# EAGLE design CaravanPi_V3 (EAGLE 9.6.2)
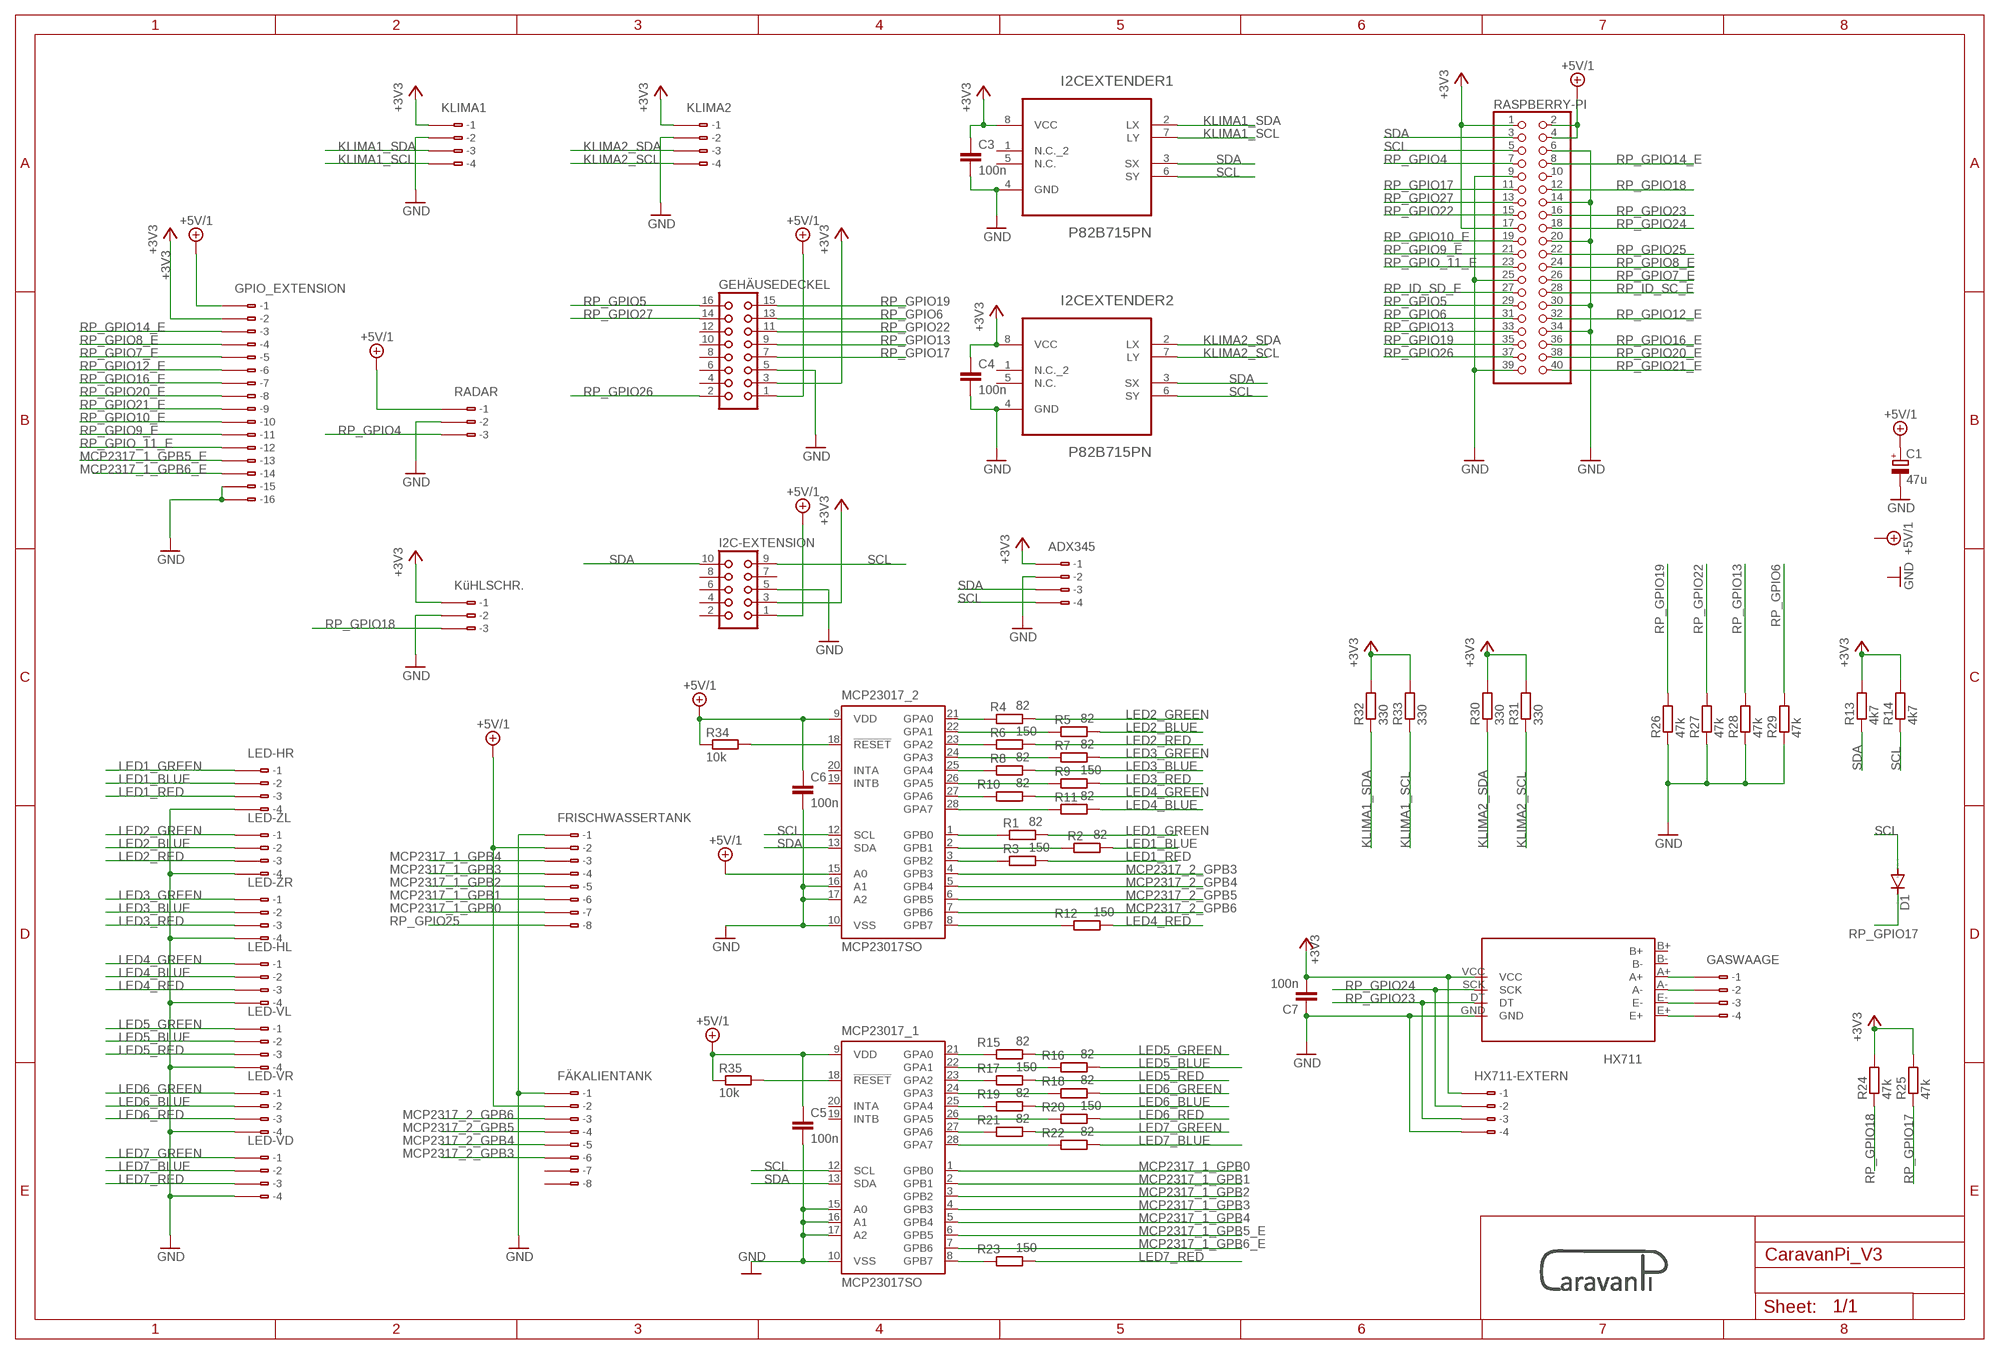
[diagram p0: schematic, sheet 1]

## Parts
ADX345  233-404  [233-404]
C1  47u  CPOL-EUSMCC  [SMC_C]
C3  100n  C-EUC1206  [C1206]
C4  100n  C-EUC1206  [C1206]
C5  100n  C-EUC1206  [C1206]
C6  100n  C-EUC1206  [C1206]
C7  100n  C-EUC1206  [C1206]
D1  DIODE-DO214AC  [DO214AC]
FRISCHWASSERTANK  233-408  [233-408]
FÄKALIENTANK  233-408  [233-408]
GASWAAGE  233-404  [233-404]
GEHÄUSEDECKEL  CON16  [CON16]
GPIO_EXTENSION  233-516  [233-516]
HX711  HX711A  [HX711]
HX711-EXTERN  233-404  [233-404]
I2C-EXTENSION  CON10  [CON10]
I2CEXTENDER1  P82B715PN  [DIP254P762X420-8]
I2CEXTENDER2  P82B715PN  [DIP254P762X420-8]
KLIMA1  233-404  [233-404]
KLIMA2  233-404  [233-404]
KüHLSCHR.  233-403  [233-403]
LED-HL  233-504  [233-504]
LED-HR  233-504  [233-504]
LED-VD  233-504  [233-504]
LED-VL  233-504  [233-504]
LED-VR  233-504  [233-504]
LED-ZL  233-504  [233-504]
LED-ZR  233-504  [233-504]
MCP23017_1  MCP23017SO  [SO28W]
MCP23017_2  MCP23017SO  [SO28W]
R1  82  R-EU_M1206  [M1206]
R2  82  R-EU_M1206  [M1206]
R3  150  R-EU_M1206  [M1206]
R4  82  R-EU_M1206  [M1206]
R5  82  R-EU_M1206  [M1206]
R6  150  R-EU_M1206  [M1206]
R7  82  R-EU_M1206  [M1206]
R8  82  R-EU_M1206  [M1206]
R9  150  R-EU_M1206  [M1206]
R10  82  R-EU_M1206  [M1206]
R11  82  R-EU_M1206  [M1206]
R12  150  R-EU_M1206  [M1206]
R13  4k7  R-EU_M1206  [M1206]
R14  4k7  R-EU_M1206  [M1206]
R15  82  R-EU_M1206  [M1206]
R16  82  R-EU_M1206  [M1206]
R17  150  R-EU_M1206  [M1206]
R18  82  R-EU_M1206  [M1206]
R19  82  R-EU_M1206  [M1206]
R20  150  R-EU_M1206  [M1206]
R21  82  R-EU_M1206  [M1206]
R22  82  R-EU_M1206  [M1206]
R23  150  R-EU_M1206  [M1206]
R24  47k  R-EU_M1206  [M1206]
R25  47k  R-EU_M1206  [M1206]
R26  47k  R-EU_M1206  [M1206]
R27  47k  R-EU_M1206  [M1206]
R28  47k  R-EU_M1206  [M1206]
R29  47k  R-EU_M1206  [M1206]
R30  330  R-EU_M1206  [M1206]
R31  330  R-EU_M1206  [M1206]
R32  330  R-EU_M1206  [M1206]
R33  330  R-EU_M1206  [M1206]
R34  10k  R-EU_M1206  [M1206]
R35  10k  R-EU_M1206  [M1206]
RADAR  233-403  [233-403]
RASPBERRY-PI  PINHD-2X20  [2X20]
U$1  CARAVAN_PI_LOGO  [CARAVAN_PI_LOGO]

## Nets
+3V3 [Power]: ADX345.B1(B-1) C3.1 C4.1 C7.2 GEHÄUSEDECKEL.3 GPIO_EXTENSION.B2(B-2) HX711-EXTERN.B1(B-1) HX711.VCC I2C-EXTENSION.3 I2CEXTENDER1.8(VCC) I2CEXTENDER2.8(VCC) KLIMA1.B1(B-1) KLIMA2.B1(B-1) KüHLSCHR..B1(B-1) R13.2 R14.2 R24.2 R25.2 R30.2 R31.2 R32.2 R33.2 RASPBERRY-PI.1 RASPBERRY-PI.17
+5V/1 [Power]: C1.+ C5.1 C6.1 FRISCHWASSERTANK.B2(B-2) FÄKALIENTANK.B2(B-2) GEHÄUSEDECKEL.1 GPIO_EXTENSION.B1(B-1) I2C-EXTENSION.1 MCP23017_1.9(VDD) MCP23017_2.9(VDD) MCP23017_2.15(A0) R34.1 R35.1 RADAR.B1(B-1) RASPBERRY-PI.2 RASPBERRY-PI.4
GND [Power]: ADX345.B2(B-2) C1.- C3.2 C4.2 C5.2 C6.2 C7.1 FRISCHWASSERTANK.B1(B-1) FÄKALIENTANK.B1(B-1) GEHÄUSEDECKEL.5 GPIO_EXTENSION.B15(B-15) GPIO_EXTENSION.B16(B-16) HX711-EXTERN.B4(B-4) HX711.GND I2C-EXTENSION.5 I2CEXTENDER1.4(GND) I2CEXTENDER2.4(GND) KLIMA1.B2(B-2) KLIMA2.B2(B-2) KüHLSCHR..B2(B-2) LED-HL.B4(B-4) LED-HR.B4(B-4) LED-VD.B4(B-4) LED-VL.B4(B-4) LED-VR.B4(B-4) LED-ZL.B4(B-4) LED-ZR.B4(B-4) MCP23017_1.10(VSS) MCP23017_1.15(A0) MCP23017_1.16(A1) MCP23017_1.17(A2) MCP23017_2.10(VSS) MCP23017_2.16(A1) MCP23017_2.17(A2) R26.1 R27.1 R28.1 R29.1 RADAR.B2(B-2) RASPBERRY-PI.6 RASPBERRY-PI.9 RASPBERRY-PI.14 RASPBERRY-PI.20 RASPBERRY-PI.25 RASPBERRY-PI.30 RASPBERRY-PI.34 RASPBERRY-PI.39
KLIMA1_SCL: I2CEXTENDER1.7(LY) KLIMA1.B4(B-4) R33.1
KLIMA1_SDA: I2CEXTENDER1.2(LX) KLIMA1.B3(B-3) R32.1
KLIMA2_SCL: I2CEXTENDER2.7(LY) KLIMA2.B4(B-4) R31.1
KLIMA2_SDA: I2CEXTENDER2.2(LX) KLIMA2.B3(B-3) R30.1
LED1_BLUE: LED-HR.B2(B-2) R2.2
LED1_GREEN: LED-HR.B1(B-1) R1.2
LED1_RED: LED-HR.B3(B-3) R3.2
LED2_BLUE: LED-ZL.B2(B-2) R5.2
LED2_GREEN: LED-ZL.B1(B-1) R4.2
LED2_RED: LED-ZL.B3(B-3) R6.2
LED3_BLUE: LED-ZR.B2(B-2) R8.2
LED3_GREEN: LED-ZR.B1(B-1) R7.2
LED3_RED: LED-ZR.B3(B-3) R9.2
LED4_BLUE: LED-HL.B2(B-2) R11.2
LED4_GREEN: LED-HL.B1(B-1) R10.2
LED4_RED: LED-HL.B3(B-3) R12.2
LED5_BLUE: LED-VL.B2(B-2) R16.2
LED5_GREEN: LED-VL.B1(B-1) R15.2
LED5_RED: LED-VL.B3(B-3) R17.2
LED6_BLUE: LED-VR.B2(B-2) R19.2
LED6_GREEN: LED-VR.B1(B-1) R18.2
LED6_RED: LED-VR.B3(B-3) R20.2
LED7_BLUE: LED-VD.B2(B-2) R22.2
LED7_GREEN: LED-VD.B1(B-1) R21.2
LED7_RED: LED-VD.B3(B-3) R23.2
MCP2317_1_GPB0: FRISCHWASSERTANK.B7(B-7) MCP23017_1.1(GPB0)
MCP2317_1_GPB1: FRISCHWASSERTANK.B6(B-6) MCP23017_1.2(GPB1)
MCP2317_1_GPB2: FRISCHWASSERTANK.B5(B-5) MCP23017_1.3(GPB2)
MCP2317_1_GPB3: FRISCHWASSERTANK.B4(B-4) MCP23017_1.4(GPB3)
MCP2317_1_GPB4: FRISCHWASSERTANK.B3(B-3) MCP23017_1.5(GPB4)
MCP2317_1_GPB5_E: GPIO_EXTENSION.B13(B-13) MCP23017_1.6(GPB5)
MCP2317_1_GPB6_E: GPIO_EXTENSION.B14(B-14) MCP23017_1.7(GPB6)
MCP2317_2_GPB3: FÄKALIENTANK.B6(B-6) MCP23017_2.4(GPB3)
MCP2317_2_GPB4: FÄKALIENTANK.B5(B-5) MCP23017_2.5(GPB4)
MCP2317_2_GPB5: FÄKALIENTANK.B4(B-4) MCP23017_2.6(GPB5)
MCP2317_2_GPB6: FÄKALIENTANK.B3(B-3) MCP23017_2.7(GPB6)
N$1: MCP23017_2.1(GPB0) R1.1
N$2: MCP23017_2.2(GPB1) R2.1
N$3: MCP23017_2.3(GPB2) R3.1
N$4: MCP23017_2.21(GPA0) R4.1
N$5: MCP23017_2.22(GPA1) R5.1
N$6: MCP23017_2.23(GPA2) R6.1
N$7: MCP23017_2.24(GPA3) R7.1
N$8: MCP23017_2.25(GPA4) R8.1
N$9: MCP23017_2.26(GPA5) R9.1
N$10: MCP23017_2.27(GPA6) R10.1
N$11: MCP23017_2.28(GPA7) R11.1
N$12: MCP23017_2.8(GPB7) R12.1
N$13: MCP23017_1.21(GPA0) R15.1
N$14: MCP23017_1.22(GPA1) R16.1
N$15: MCP23017_1.23(GPA2) R17.1
N$16: MCP23017_1.24(GPA3) R18.1
N$17: MCP23017_1.25(GPA4) R19.1
N$18: MCP23017_1.26(GPA5) R20.1
N$19: MCP23017_1.27(GPA6) R21.1
N$20: MCP23017_1.28(GPA7) R22.1
N$21: MCP23017_2.18(!RESET) R34.2
N$22: MCP23017_1.18(!RESET) R35.2
N$23: GASWAAGE.B4(B-4) HX711.E+
N$24: GASWAAGE.B3(B-3) HX711.E-
N$25: GASWAAGE.B2(B-2) HX711.A-
N$26: GASWAAGE.B1(B-1) HX711.A+
N$29: MCP23017_1.8(GPB7) R23.1
RP_GPIO4: RADAR.B3(B-3) RASPBERRY-PI.7
RP_GPIO5: GEHÄUSEDECKEL.16 RASPBERRY-PI.29
RP_GPIO6: GEHÄUSEDECKEL.13 R29.2 RASPBERRY-PI.31
RP_GPIO7_E: GPIO_EXTENSION.B5(B-5) RASPBERRY-PI.26
RP_GPIO8_E: GPIO_EXTENSION.B4(B-4) RASPBERRY-PI.24
RP_GPIO9_E: GPIO_EXTENSION.B11(B-11) RASPBERRY-PI.21
RP_GPIO10_E: GPIO_EXTENSION.B10(B-10) RASPBERRY-PI.19
RP_GPIO12_E: GPIO_EXTENSION.B6(B-6) RASPBERRY-PI.32
RP_GPIO13: GEHÄUSEDECKEL.9 R28.2 RASPBERRY-PI.33
RP_GPIO14_E: GPIO_EXTENSION.B3(B-3) RASPBERRY-PI.8
RP_GPIO16_E: GPIO_EXTENSION.B7(B-7) RASPBERRY-PI.36
RP_GPIO17: D1.C GEHÄUSEDECKEL.7 R25.1 RASPBERRY-PI.11
RP_GPIO18: KüHLSCHR..B3(B-3) R24.1 RASPBERRY-PI.12
RP_GPIO19: GEHÄUSEDECKEL.15 R26.2 RASPBERRY-PI.35
RP_GPIO20_E: GPIO_EXTENSION.B8(B-8) RASPBERRY-PI.38
RP_GPIO21_E: GPIO_EXTENSION.B9(B-9) RASPBERRY-PI.40
RP_GPIO22: GEHÄUSEDECKEL.11 R27.2 RASPBERRY-PI.15
RP_GPIO23: HX711-EXTERN.B3(B-3) HX711.DT RASPBERRY-PI.16
RP_GPIO24: HX711-EXTERN.B2(B-2) HX711.SCK RASPBERRY-PI.18
RP_GPIO25: FRISCHWASSERTANK.B8(B-8) RASPBERRY-PI.22
RP_GPIO26: GEHÄUSEDECKEL.2 RASPBERRY-PI.37
RP_GPIO27: GEHÄUSEDECKEL.14 RASPBERRY-PI.13
RP_GPIO_11_E: GPIO_EXTENSION.B12(B-12) RASPBERRY-PI.23
RP_ID_SC_E: RASPBERRY-PI.28
RP_ID_SD_E: RASPBERRY-PI.27
SCL: ADX345.B4(B-4) D1.A I2C-EXTENSION.9 I2CEXTENDER1.6(SY) I2CEXTENDER2.6(SY) MCP23017_1.12(SCL) MCP23017_2.12(SCL) R14.1 RASPBERRY-PI.5
SDA: ADX345.B3(B-3) I2C-EXTENSION.10 I2CEXTENDER1.3(SX) I2CEXTENDER2.3(SX) MCP23017_1.13(SDA) MCP23017_2.13(SDA) R13.1 RASPBERRY-PI.3
Unconnected: ADX345.A1(-1) ADX345.A2(-2) ADX345.A3(-3) ADX345.A4(-4) FRISCHWASSERTANK.A1(-1) FRISCHWASSERTANK.A2(-2) FRISCHWASSERTANK.A3(-3) FRISCHWASSERTANK.A4(-4) FRISCHWASSERTANK.A5(-5) FRISCHWASSERTANK.A6(-6) FRISCHWASSERTANK.A7(-7) FRISCHWASSERTANK.A8(-8) FÄKALIENTANK.A1(-1) FÄKALIENTANK.A2(-2) FÄKALIENTANK.A3(-3) FÄKALIENTANK.A4(-4) FÄKALIENTANK.A5(-5) FÄKALIENTANK.A6(-6) FÄKALIENTANK.A7(-7) FÄKALIENTANK.A8(-8) FÄKALIENTANK.B7(B-7) FÄKALIENTANK.B8(B-8) GASWAAGE.A1(-1) GASWAAGE.A2(-2) GASWAAGE.A3(-3) GASWAAGE.A4(-4) GEHÄUSEDECKEL.4 GEHÄUSEDECKEL.6 GEHÄUSEDECKEL.8 GEHÄUSEDECKEL.10 GEHÄUSEDECKEL.12 GPIO_EXTENSION.A1(-1) GPIO_EXTENSION.A2(-2) GPIO_EXTENSION.A3(-3) GPIO_EXTENSION.A4(-4) GPIO_EXTENSION.A5(-5) GPIO_EXTENSION.A6(-6) GPIO_EXTENSION.A7(-7) GPIO_EXTENSION.A8(-8) GPIO_EXTENSION.A9(-9) GPIO_EXTENSION.A10(-10) GPIO_EXTENSION.A11(-11) GPIO_EXTENSION.A12(-12) GPIO_EXTENSION.A13(-13) GPIO_EXTENSION.A14(-14) GPIO_EXTENSION.A15(-15) GPIO_EXTENSION.A16(-16) HX711-EXTERN.A1(-1) HX711-EXTERN.A2(-2) HX711-EXTERN.A3(-3) HX711-EXTERN.A4(-4) HX711.B+ HX711.B- I2C-EXTENSION.2 I2C-EXTENSION.4 I2C-EXTENSION.6 I2C-EXTENSION.7 I2C-EXTENSION.8 I2CEXTENDER1.1(N.C._2) I2CEXTENDER1.5(N.C.) I2CEXTENDER2.1(N.C._2) I2CEXTENDER2.5(N.C.) KLIMA1.A1(-1) KLIMA1.A2(-2) KLIMA1.A3(-3) KLIMA1.A4(-4) KLIMA2.A1(-1) KLIMA2.A2(-2) KLIMA2.A3(-3) KLIMA2.A4(-4) KüHLSCHR..A1(-1) KüHLSCHR..A2(-2) KüHLSCHR..A3(-3) LED-HL.A1(-1) LED-HL.A2(-2) LED-HL.A3(-3) LED-HL.A4(-4) LED-HR.A1(-1) LED-HR.A2(-2) LED-HR.A3(-3) LED-HR.A4(-4) LED-VD.A1(-1) LED-VD.A2(-2) LED-VD.A3(-3) LED-VD.A4(-4) LED-VL.A1(-1) LED-VL.A2(-2) LED-VL.A3(-3) LED-VL.A4(-4) LED-VR.A1(-1) LED-VR.A2(-2) LED-VR.A3(-3) LED-VR.A4(-4) LED-ZL.A1(-1) LED-ZL.A2(-2) LED-ZL.A3(-3) LED-ZL.A4(-4) LED-ZR.A1(-1) LED-ZR.A2(-2) LED-ZR.A3(-3) LED-ZR.A4(-4) MCP23017_1.19(INTB) MCP23017_1.20(INTA) MCP23017_2.19(INTB) MCP23017_2.20(INTA) RADAR.A1(-1) RADAR.A2(-2) RADAR.A3(-3) RASPBERRY-PI.10

## Library data of the parts
ADX345 GASWAAGE HX711-EXTERN KLIMA1 KLIMA2 = con-wago:233-404: WAGO Cage Clamp; MPN: 233-404; OC_FARNELL: 1601355; OC_NEWARK: 28K9077
C1 = rcl:CPOL-EU: POLARIZED CAPACITOR, European symbol
C3-C7 = rcl:C-EU: CAPACITOR, European symbol; SPICEPREFIX: C
D1 = diode:DIODE-: DIODE
FRISCHWASSERTANK FÄKALIENTANK = con-wago:233-408: WAGO Cage Clamp; MPN: 233-408; OC_FARNELL: 1601358; OC_NEWARK: 28K9080
GEHÄUSEDECKEL = con-harting:CON16: CONNECTOR; OC_FARNELL: unknown; OC_NEWARK: unknown
GPIO_EXTENSION = con-wago:233-516: WAGO Cage Clamp; MF: Wago Corporation; MPN: 0233-0516; OC_FARNELL: 1777103; OC_NEWARK: 79K2056
HX711 = HX711:HX711
I2C-EXTENSION = con-harting:CON10: CONNECTOR; OC_FARNELL: unknown; OC_NEWARK: unknown
I2CEXTENDER1 I2CEXTENDER2 = NXP_By_element14_Batch_1:P82B715PN: I2C-bus extender; MPN: P82B715PN; OC_FARNELL: 1211741; OC_NEWARK: 24M6586; PACKAGE: DIP-8; SUPPLIER: NXP
KüHLSCHR. RADAR = con-wago:233-403: WAGO Cage Clamp; MPN: 233-403; OC_FARNELL: 1601354; OC_NEWARK: 28K9076
LED-HL LED-HR LED-VD LED-VL LED-VR LED-ZL LED-ZR = con-wago:233-504: WAGO Cage Clamp; MF: Wago Corporation; MPN: 0233-0504; OC_FARNELL: 1777098; OC_NEWARK: 79K2050
MCP23017_1 MCP23017_2 = adafruit:MCP23017: http://ww1.microchip.com/downloads/en/DeviceDoc/21952a.pdf Source: http://ww1.microchip.com/downloads/en/DeviceDoc/21952a.pdf
R1-R35 = rcl:R-EU_: RESISTOR, European symbol; SPICEPREFIX: R
RASPBERRY-PI = pinhead:PINHD-2X20: PIN HEADER
U$1 = caravanPI_logo:CARAVAN_PI_LOGO: Caravan_PI_logo

## Net classes
0 default: width 0.508 mm, drill 0.305 mm
1 Power: width 1.016 mm

## Board
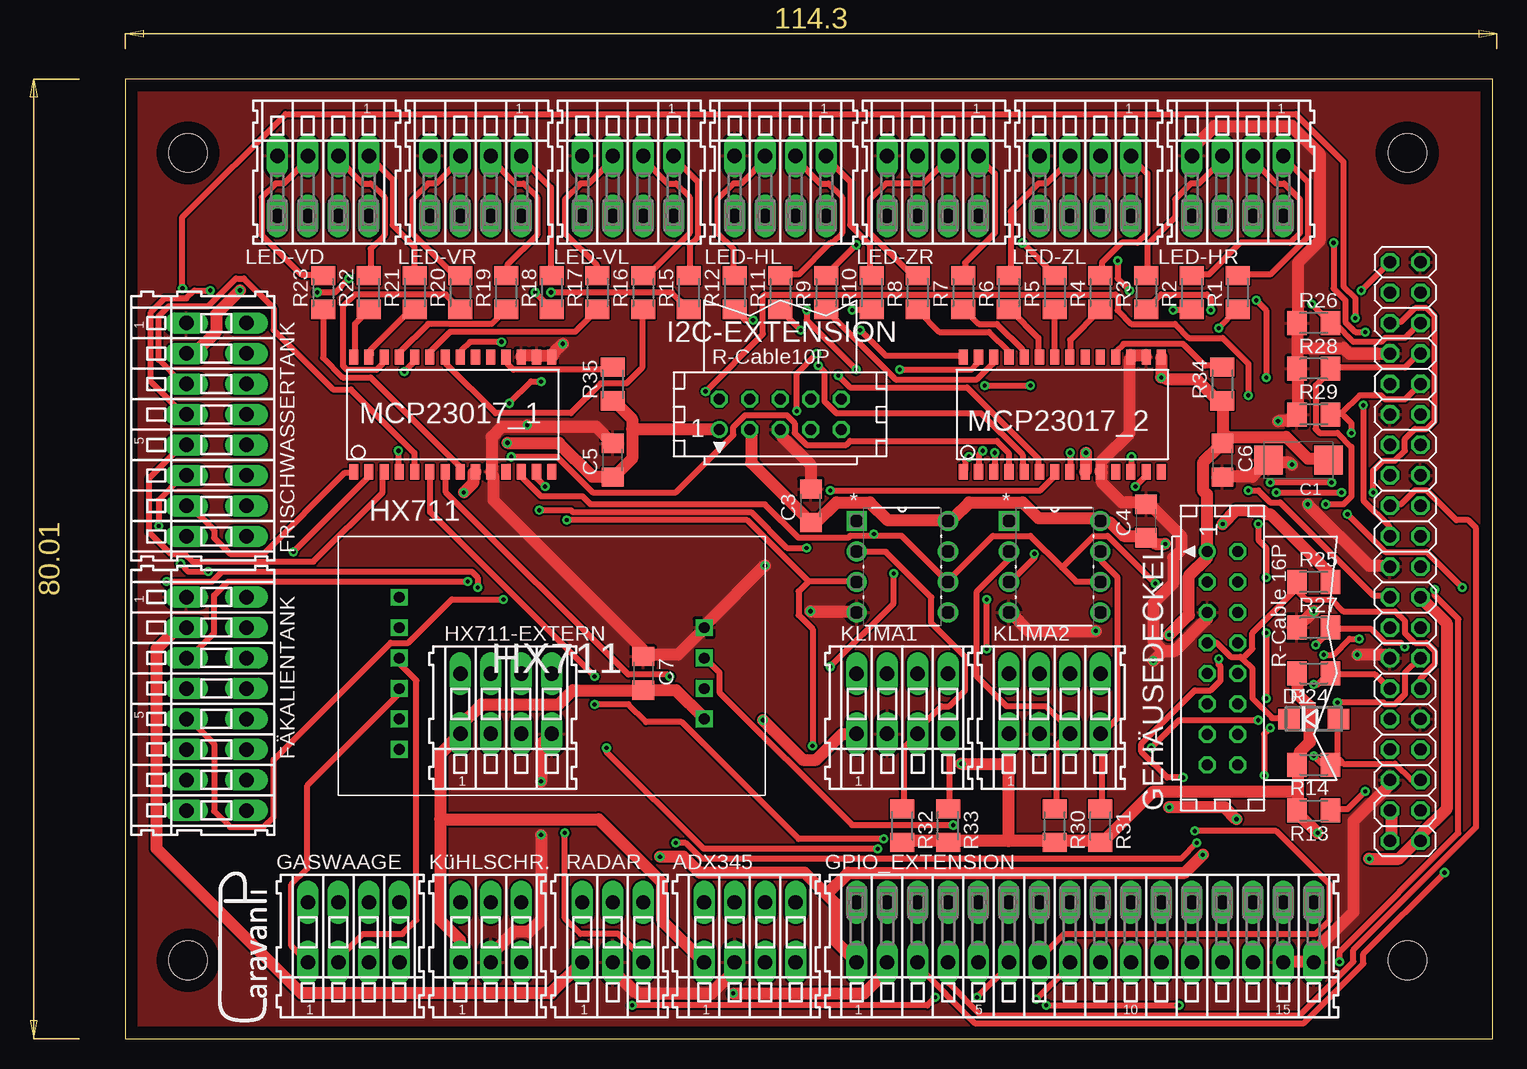
[diagram p1: board, top side]
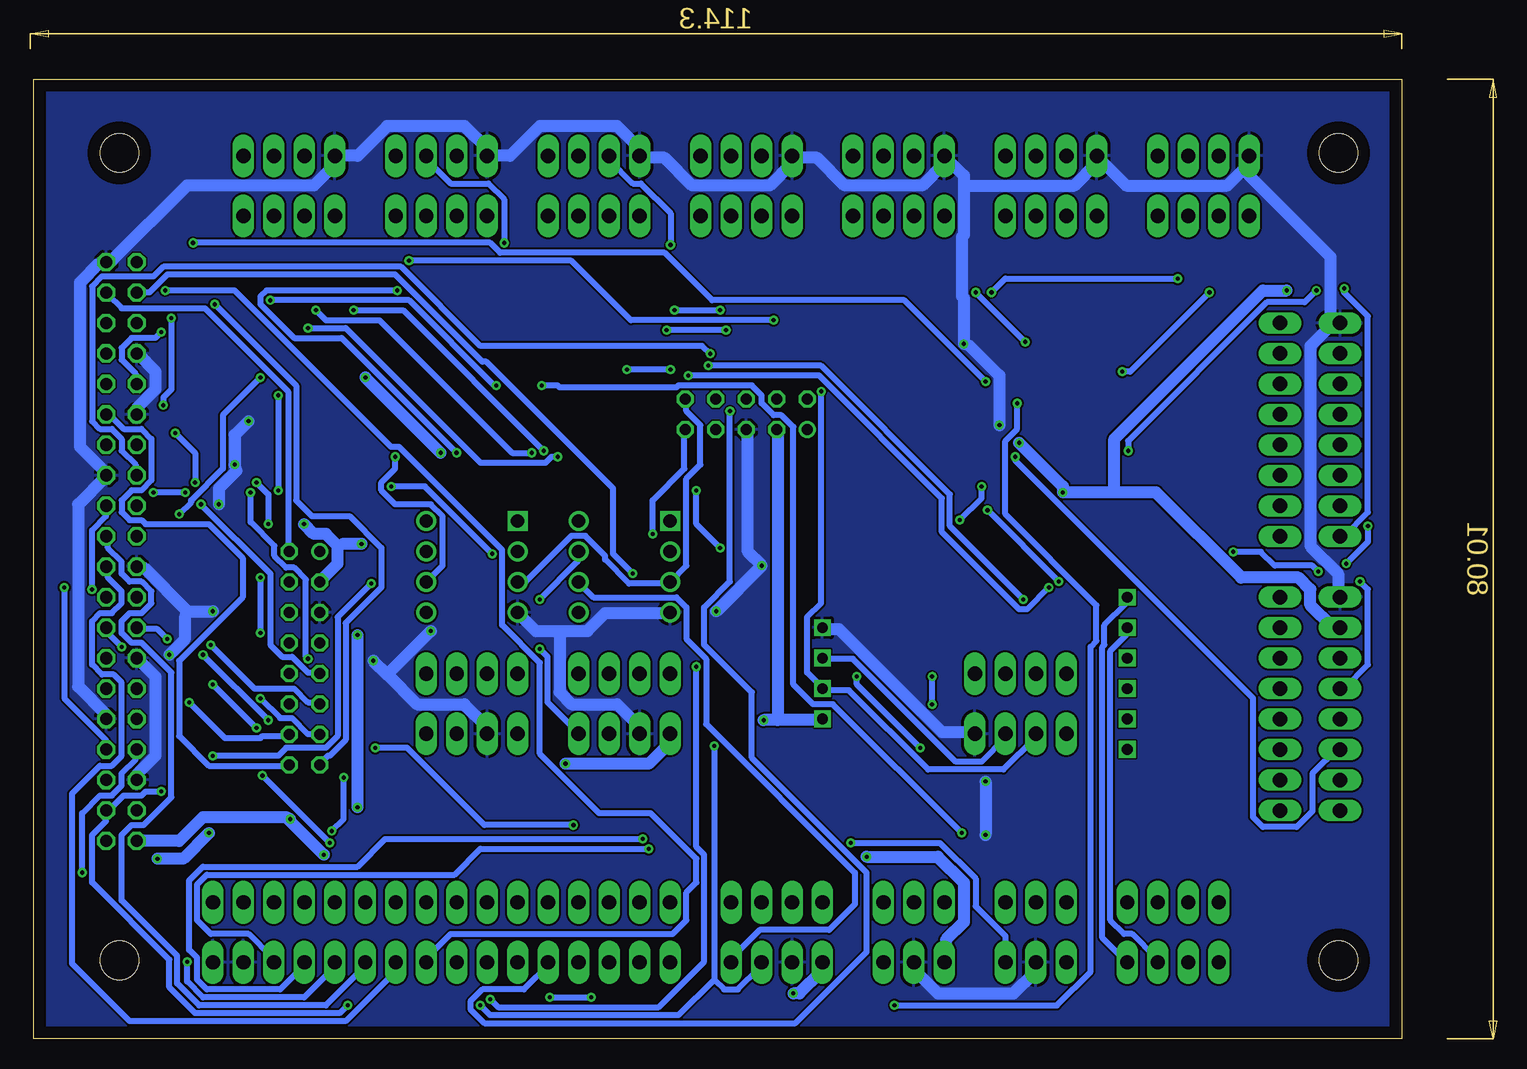
[diagram p2: board, bottom side, seen from below]

Size 113.97 x 80 mm. Coordinates in mm from the lower left corner, seen from the top.
Outline: 0,0 113.97,0 113.97,80 0,80 0,0
Copper layers (1*16): Top 0.035mm / dielectric 1.5mm / Bottom 0.035mm
Design rules "default": minimum track width 6mil, minimum drill 0.35mm, track to track 6mil, track to pad 6mil, pad to pad 6mil, via to via 6mil, smd to smd 6mil, copper to edge 40mil, drill to drill 6mil, minimum pad ring 10mil, minimum via ring 8mil, stop-mask expansion 4mil, vias tented up to drill 0mil, thermal gap 10mil
Holes 3.2 mm at 5.25,73.86 106.86,73.86 106.86,6.55 5.25,6.55

### Footprints (pad centres in the part's own frame; a part is rotated, then mirrored left to right if it is on the bottom)
233-404 = drill 1.2 long: A1 -3.81,2.5; A2 -1.27,2.5; A3 1.27,2.5; A4 3.81,2.5; B1 -3.81,-2.5; B2 -1.27,-2.5; B3 1.27,-2.5; B4 3.81,-2.5
SMC_C = smd 2.4 x 2.4: + -2.5,0; - 2.5,0
C1206 = smd 1.6 x 1.8: 1 -1.4,0; 2 1.4,0
DO214AC = smd 1.8 x 1.7: A 2.05,0; C -2.05,0
233-408 = drill 1.2 long: A1 -8.89,2.5; A2 -6.35,2.5; A3 -3.81,2.5; A4 -1.27,2.5; A5 1.27,2.5; A6 3.81,2.5; A7 6.35,2.5; A8 8.89,2.5; B1 -8.89,-2.5; B2 -6.35,-2.5; B3 -3.81,-2.5; B4 -1.27,-2.5; B5 1.27,-2.5; B6 3.81,-2.5; B7 6.35,-2.5; B8 8.89,-2.5
CON16 = drill 0.914: 1 -8.89,-1.27 | drill 0.914 octagon: 2 -8.89,1.27; 3 -6.35,-1.27; 4 -6.35,1.27; 5 -3.81,-1.27; 6 -3.81,1.27; 7 -1.27,-1.27; 8 -1.27,1.27; 9 1.27,-1.27; 10 1.27,1.27; 11 3.81,-1.27; 12 3.81,1.27; 13 6.35,-1.27; 14 6.35,1.27; 15 8.89,-1.27; 16 8.89,1.27
233-516 = drill 1.2 long: A1 -19.05,2.5; A2 -16.51,2.5; A3 -13.97,2.5; A4 -11.43,2.5; A5 -8.89,2.5; A6 -6.35,2.5; A7 -3.81,2.5; A8 -1.27,2.5; A9 1.27,2.5; A10 3.81,2.5; A11 6.35,2.5; A12 8.89,2.5; A13 11.43,2.5; A14 13.97,2.5; A15 16.51,2.5; A16 19.05,2.5; B1 -19.05,-2.5; B2 -16.51,-2.5; B3 -13.97,-2.5; B4 -11.43,-2.5; B5 -8.89,-2.5; B6 -6.35,-2.5; B7 -3.81,-2.5; B8 -1.27,-2.5; B9 1.27,-2.5; B10 3.81,-2.5; B11 6.35,-2.5; B12 8.89,-2.5; B13 11.43,-2.5; B14 13.97,-2.5; B15 16.51,-2.5; B16 19.05,-2.5
HX711 = drill 0.9 square: A+ 5.08,8.89; A- 5.08,11.43; B+ 5.08,3.81; B- 5.08,6.35; DT 30.48,11.43; E+ 5.08,16.51; E- 5.08,13.97; GND 30.48,13.97; SCK 30.48,8.89; VCC 30.48,6.35
CON10 = drill 0.914: 1 -5.08,-1.27 | drill 0.914 octagon: 2 -5.08,1.27; 3 -2.54,-1.27; 4 -2.54,1.27; 5 0,-1.27; 6 0,1.27; 7 2.54,-1.27; 8 2.54,1.27; 9 5.08,-1.27; 10 5.08,1.27
DIP254P762X420-8 = drill 1.118 square: 1 -7.62,7.62 | drill 1.118: 2 -7.62,5.08; 3 -7.62,2.54; 4 -7.62,0; 5 0,0; 6 0,2.54; 7 0,5.08; 8 0,7.62
233-403 = drill 1.2 long: A1 -2.54,2.5; A2 0,2.5; A3 2.54,2.5; B1 -2.54,-2.5; B2 0,-2.5; B3 2.54,-2.5
233-504 = drill 1.2 long: A1 -3.81,2.5; A2 -1.27,2.5; A3 1.27,2.5; A4 3.81,2.5; B1 -3.81,-2.5; B2 -1.27,-2.5; B3 1.27,-2.5; B4 3.81,-2.5
SO28W = smd 0.762 x 1.27: 1 -7.62,-4.78; 2 -6.35,-4.78; 3 -5.08,-4.78; 4 -3.81,-4.78; 5 -2.54,-4.78; 6 -1.27,-4.78; 7 0,-4.78; 8 1.27,-4.78; 9 2.54,-4.78; 10 3.81,-4.78; 11 5.08,-4.78; 12 6.35,-4.78; 13 7.62,-4.78; 14 8.89,-4.78; 15 8.89,4.78; 16 7.62,4.78; 17 6.35,4.78; 18 5.08,4.78; 19 3.81,4.78; 20 2.54,4.78; 21 1.27,4.78; 22 0,4.78; 23 -1.27,4.78; 24 -2.54,4.78; 25 -3.81,4.78; 26 -5.08,4.78; 27 -6.35,4.78; 28 -7.62,4.78
M1206 = smd 1.6 x 2: 1 -1.4,0; 2 1.4,0
2X20 = drill 1.016 octagon: 1 -24.13,-1.27; 2 -24.13,1.27; 3 -21.59,-1.27; 4 -21.59,1.27; 5 -19.05,-1.27; 6 -19.05,1.27; 7 -16.51,-1.27; 8 -16.51,1.27; 9 -13.97,-1.27; 10 -13.97,1.27; 11 -11.43,-1.27; 12 -11.43,1.27; 13 -8.89,-1.27; 14 -8.89,1.27; 15 -6.35,-1.27; 16 -6.35,1.27; 17 -3.81,-1.27; 18 -3.81,1.27; 19 -1.27,-1.27; 20 -1.27,1.27; 21 1.27,-1.27; 22 1.27,1.27; 23 3.81,-1.27; 24 3.81,1.27; 25 6.35,-1.27; 26 6.35,1.27; 27 8.89,-1.27; 28 8.89,1.27; 29 11.43,-1.27; 30 11.43,1.27; 31 13.97,-1.27; 32 13.97,1.27; 33 16.51,-1.27; 34 16.51,1.27; 35 19.05,-1.27; 36 19.05,1.27; 37 21.59,-1.27; 38 21.59,1.27; 39 24.13,-1.27; 40 24.13,1.27

### Placement (x,y rotation side)
ADX345  52.07,8.89 0 top
C1  97.79,48.26 180 top
C3  57.15,44.45 90 top
C4  85.09,43.18 90 top
C5  40.64,48.26 90 top
C6  91.44,48.26 270 top
C7  43.18,30.48 270 top
D1  99.06,26.67 0 top
FRISCHWASSERTANK  7.62,50.8 270 top
FÄKALIENTANK  7.62,27.94 270 top
GASWAAGE  19.05,8.89 0 top
GEHÄUSEDECKEL  91.44,31.75 270 top
GPIO_EXTENSION  80.01,8.89 0 top
HX711  17.78,20.32 0 top
HX711-EXTERN  31.75,27.94 0 top
I2C-EXTENSION  54.61,52.07 0 top
I2CEXTENDER1  68.58,35.56 0 top
I2CEXTENDER2  81.28,35.56 0 top
KLIMA1  64.77,27.94 0 top
KLIMA2  77.47,27.94 0 top
KüHLSCHR.  30.48,8.89 0 top
LED-HL  54.61,71.12 180 top
LED-HR  92.71,71.12 180 top
LED-VD  16.51,71.12 180 top
LED-VL  41.91,71.12 180 top
LED-VR  29.21,71.12 180 top
LED-ZL  80.01,71.12 180 top
LED-ZR  67.31,71.12 180 top
MCP23017_1  26.67,52.07 0 top
MCP23017_2  77.47,52.07 0 top
R1  92.71,62.23 90 top
R2  88.9,62.23 90 top
R3  85.09,62.23 90 top
R4  81.28,62.23 90 top
R5  77.47,62.23 90 top
R6  73.66,62.23 90 top
R7  69.85,62.23 90 top
R8  66.04,62.23 90 top
R9  58.42,62.23 90 top
R10  62.23,62.23 90 top
R11  54.61,62.23 90 top
R12  50.8,62.23 90 top
R13  99.06,19.05 180 top
R14  99.06,22.86 180 top
R15  46.99,62.23 90 top
R16  43.18,62.23 90 top
R17  39.37,62.23 90 top
R18  35.56,62.23 90 top
R19  31.75,62.23 90 top
R20  27.94,62.23 90 top
R21  24.13,62.23 90 top
R22  20.32,62.23 90 top
R23  16.51,62.23 90 top
R24  99.06,30.48 180 top
R25  99.06,38.1 0 top
R26  99.06,59.69 0 top
R27  99.06,34.29 0 top
R28  99.06,55.88 0 top
R29  99.06,52.07 0 top
R30  77.47,17.78 270 top
R31  81.28,17.78 270 top
R32  64.77,17.78 270 top
R33  68.58,17.78 270 top
R34  91.44,54.61 90 top
R35  40.64,54.61 90 top
RADAR  40.64,8.89 0 top
RASPBERRY-PI  106.68,40.64 90 top
U$1  12.7,1.27 90 top

### Tracks (layer width: path | path; a pad name or v marks a point on that pad's centre or on a via)
+3V3  (via drill 0.35)
  Top 1.016: RASPBERRY-PI.17 107.97,36.82 110.12,34.67 110.12,19.15 107.97,17 107.97,16.51 RASPBERRY-PI.1 107.48,16.34 106.16,15.02 v103.68,15.02 | 97.74,20.64 97.74,22.78 R14.2 97.9,23.28 97.9,23.94 98.73,24.77 98.73,27.74 97.74,28.73 97.74,30.38 R24.2 | 97.74,20.64 97.74,19.15 R13.2 97.9,18.66 v99.39,17.17 | R32.2 64.88,16.51 68.52,16.51 R33.2 69.01,16.51 73.64,16.51 | 73.64,16.51 77.1,16.51 R30.2 77.6,16.51 81.23,16.51 R31.2 81.72,16.68 85.69,20.64 97.74,20.64 | 73.64,16.51 73.64,22.95 | 73.64,22.95 73.64,25.43 KLIMA2.B1 | HX711.VCC 48.21,26.75 45.9,29.06 43.26,29.06 C7.2 42.76,29.06 37.31,29.06 36.16,27.9 29.72,27.9 27.74,25.92 HX711-EXTERN.B1 27.9,25.43 26.25,23.77 26.25,18.33 | v53.16,26.58 56.46,23.28 57.62,23.28 59.77,25.43 60.92,25.43 KLIMA1.B1 | 26.25,18.33 26.25,9.91 27.9,8.26 27.9,6.44 KüHLSCHR..B1 | 26.25,18.33 39.46,18.33 44.74,13.04 44.74,9.91 48.21,6.44 ADX345.B1 | v50.69,3.8 61.58,3.8 63.4,5.61 63.4,6.27 GPIO_EXTENSION.B2 | v91.47,42.93 92.62,44.08 94.77,44.08 95.1,43.75 95.43,43.75 100.38,38.8 100.38,38.14 R25.2 | I2C-EXTENSION.3 52.17,50.69 52.17,48.04 57.12,43.09 C3.1 57.62,43.09 59.27,44.74 62.08,44.74 63.56,43.26 68.52,43.26 I2CEXTENDER1.8 69.01,43.42 70.33,44.74 74.79,44.74 76.11,43.42 80.9,43.42 I2CEXTENDER2.8 81.39,43.09 82.06,43.09 83.21,41.94 85.03,41.94 C4.1 85.52,41.6 85.85,41.27 v86.68,41.27 | v69.67,22.95 73.64,22.95
  Bottom 1.016: v103.68,15.02 101.54,15.02 v99.39,17.17 | 52.01,26.58 48.37,26.58 HX711.VCC | 52.01,26.58 v53.16,26.58 | v50.69,3.8 50.19,3.8 48.37,5.61 48.37,6.27 ADX345.B1 | v91.47,42.93 90.64,42.1 89.65,42.1 88.66,41.11 | 88.66,41.11 88.66,39.62 90.14,38.14 GEHÄUSEDECKEL.3 | v86.68,41.27 88.16,41.27 88.66,41.11 | 52.01,26.58 52.01,50.69 I2C-EXTENSION.3 | v69.67,22.95 62.74,22.95 61.09,24.6 61.09,25.43 KLIMA1.B1
+5V/1  (via drill 0.35)
  Top 1.016: 42.27,50.85 42.27,51.68 40.78,53.16 R35.1 | 42.27,50.85 42.27,48.37 40.78,46.89 C5.1 40.12,46.89 38.96,46.89 36.16,49.7 v31.86,49.7 | 42.27,50.85 49.53,50.85 I2C-EXTENSION.1 | v28.23,45.57 29.06,46.39 29.06,47.22 MCP23017_1.9 | v9.58,62.41 7.59,60.43 7.59,58.94 5.94,57.29 5.28,57.29 FRISCHWASSERTANK.B2 | v80.07,48.87 80.07,47.38 MCP23017_2.9 | MCP23017_2.15 86.35,56.79 v86.35,55.14 86.84,54.98 89.32,54.98 90.97,53.33 R34.1 91.47,53.16 91.47,49.7 C6.1 | C1.+ 100.22,48.37 98.56,48.37 96.75,50.19 91.96,50.19 C6.1 | C6.1 91.14,49.37 89.81,48.04 89.81,45.73 90.14,45.4 90.14,40.78 GEHÄUSEDECKEL.1 90.14,40.12 88.66,38.63 88.66,35.33 v87.01,33.68 | RASPBERRY-PI.2 105.5,16.51 105.5,18.99 RASPBERRY-PI.4 | v44.58,15.19 46.56,15.19 47.88,13.87 56.63,13.87 58.45,12.05 | 58.45,12.05 59.27,11.23 59.27,8.09 60.92,6.44 GPIO_EXTENSION.B1 | v89.81,15.35 88.33,13.87 60.26,13.87 58.45,12.05 | v87.01,19.32 91.63,19.32 v92.62,18.33 | FÄKALIENTANK.B2 5.12,34.18 4.29,34.18 2.64,32.52 2.64,15.85 14.69,3.8 35.5,3.8 37.97,6.27 RADAR.B1
  Bottom 1.016: 23.94,45.57 20.47,45.57 13.37,38.47 8.59,38.47 7.59,37.48 7.59,36.16 5.78,34.34 5.28,34.34 FÄKALIENTANK.B2 | 23.94,45.57 v28.23,45.57 28.23,46.06 v31.86,49.7 | v9.58,62.41 11.56,62.41 23.94,50.02 23.94,45.57 | v86.35,55.14 v80.07,48.87 | v44.58,15.19 38.63,15.19 36.49,13.04 36.49,9.74 37.97,8.26 37.97,6.44 RADAR.B1 | RASPBERRY-PI.2 101.87,16.51 99.89,18.49 92.95,18.49 | v89.81,15.35 92.95,18.49 | v87.01,19.32 v87.01,33.68 | v92.62,18.33 92.95,18.49
GND  (via drill 0.35)
  Top 1.016: MCP23017_2.16 85.03,56.96 83.87,56.96 MCP23017_2.17 83.71,56.46 83.71,50.52 81.39,48.21 81.39,47.71 MCP23017_2.10 81.39,47.22 81.39,46.39 83.05,44.74 85.03,44.74 C4.2 85.52,44.41 88,41.94 88,40.78 87.34,40.12 87.34,37.97 85.69,36.32 85.69,33.19 86.51,32.36 | 86.51,32.36 87.5,32.36 90.14,35 90.14,35.5 GEHÄUSEDECKEL.5 | 86.51,32.36 v85.69,31.53 | ADX345.B2 50.69,6.27 50.69,5.61 48.87,3.8 42.76,3.8 42.6,3.96 42.43,3.96 40.78,5.61 40.78,6.27 RADAR.B2 | 33.52,51.02 39.29,51.02 40.62,49.7 C5.2 | 33.52,51.02 31.37,51.02 30.54,50.19 30.54,47.38 MCP23017_1.10 30.71,46.89 30.71,44.91 43.09,32.52 C7.1 43.26,32.03 46.06,32.03 48.21,34.18 HX711.GND 48.54,34.67 v53.33,39.46 | C3.2 57.12,45.9 57.12,47.88 54.65,50.35 54.65,50.69 I2C-EXTENSION.5 | v34.67,17 34.67,9.91 33.68,8.91 32.36,8.91 30.54,7.1 30.54,6.44 KüHLSCHR..B2 | v34.67,21.46 34.67,24.6 35.5,25.43 HX711-EXTERN.B4 | v57.12,35.66 60.92,35.66 I2CEXTENDER1.4 | v80.9,34.01 75.29,34.01 73.8,35.5 I2CEXTENDER2.4 | v99.06,35.66 97.74,34.34 R27.1 | GPIO_EXTENSION.B15 96.58,6.44 99.06,6.44 GPIO_EXTENSION.B16 99.22,6.93 99.22,7.43 102.36,10.57 102.36,18.16 105.33,21.13 105.33,21.46 RASPBERRY-PI.6 | v102.69,32.03 105.17,32.03 105.33,31.86 RASPBERRY-PI.14 | C6.2 91.47,46.89 93.94,46.89 95.26,48.21 C1.- 95.76,48.04 97.08,48.04 v97.24,47.88 | 97.74,57.62 97.74,56.3 R28.1 97.74,55.8 97.74,52.17 R29.1 97.24,51.84 96.91,51.51 v96.09,51.51 | 97.74,57.62 97.74,59.6 R26.1 97.74,60.1 97.74,64.72 99.56,66.53 99.56,73.8 97.24,76.11 90.81,76.11 88.99,74.3 88.99,73.64 LED-HR.B4 | 97.74,57.62 101.54,57.62 102.03,57.12 105.33,57.12 RASPBERRY-PI.34
  Top 1.016: 34.18,56.96 33.02,56.96 MCP23017_1.17 | 34.18,56.96 MCP23017_1.16 | 34.18,56.96 35.5,56.96 MCP23017_1.15 35.83,57.29 v36.49,57.95 | v98.56,44.58 103.68,39.46 105.33,39.46 RASPBERRY-PI.20 | v33.52,51.18 33.52,51.02
  Bottom 1.016: v85.69,31.53 84.53,30.38 | 84.53,30.38 82.06,27.9 78.09,27.9 76.28,26.09 76.28,25.59 KLIMA2.B2 | 70.17,34.01 72.15,34.01 73.64,35.5 I2CEXTENDER2.4 | 70.17,34.01 67.86,34.01 66.37,35.5 61.09,35.5 I2CEXTENDER1.4 | 70.17,34.01 70.17,28.89 69.18,27.9 65.38,27.9 63.56,26.09 63.56,25.59 KLIMA1.B2 | KüHLSCHR..B2 30.54,6.27 30.54,5.61 32.36,3.8 38.63,3.8 40.62,5.78 40.62,6.27 RADAR.B2 | HX711-EXTERN.B4 35.66,25.59 38.3,25.59 46.89,34.18 48.21,34.18 HX711.GND | I2C-EXTENSION.5 54.48,50.69 54.48,40.62 v53.33,39.46 v57.12,35.66 | v34.67,21.46 v34.67,17 | v80.9,34.01 84.53,30.38 | 101.21,35.66 v99.06,35.66 | 101.21,35.66 104.84,39.29 105.33,39.29 RASPBERRY-PI.20 | RASPBERRY-PI.6 105.33,21.63 105.33,22.12 103.85,23.61 103.85,30.21 105.33,31.7 RASPBERRY-PI.14 | v102.69,32.03 101.37,33.35 101.37,35.17 101.21,35.66 | RASPBERRY-PI.9 107.97,26.75 107.97,27.08 110.29,29.39 110.29,44.58 107.97,46.89 RASPBERRY-PI.25 108.14,47.38 110.12,49.37 110.12,63.07 108.47,64.72 107.97,64.72 RASPBERRY-PI.39 107.48,64.88 101.21,71.16 90.64,71.16 88.66,73.14 LED-HR.B4 88.82,73.64 87.01,73.64 84.53,76.11 78.09,76.11 76.11,74.13 LED-ZL.B4 76.11,73.64 74.3,73.64 71.82,76.11 65.38,76.11 63.56,74.3 63.56,74.13 LED-ZR.B4 63.4,73.47 61.42,73.47 59.11,71.16 52.67,71.16 50.85,72.97 LED-HL.B4 50.69,73.47 48.7,73.47 46.39,71.16 39.95,71.16 38.14,72.97 LED-VL.B4 37.97,73.47 36.49,71.98 36.49,71.16 | FÄKALIENTANK.B1 5.28,36.98 5.28,38.8 7.59,41.11 7.59,57.78 5.78,59.6 5.28,59.6 FRISCHWASSERTANK.B1 5.94,60.1 5.94,65.22 12.88,72.15 LED-VD.B4 12.71,73.47 12.71,72.97 14.53,71.16 22.95,71.16 25.26,73.47 LED-VR.B4 25.43,72.97 27.24,71.16 36.49,71.16
  Bottom 1.016: RASPBERRY-PI.30 105.33,52.17 105.33,52.67 103.85,54.15 103.85,55.64 105.33,57.12 RASPBERRY-PI.34 | v96.09,51.51 97.24,50.35 v97.24,47.88 97.08,47.38 98.56,45.9 v98.56,44.58 | 36.49,71.16 36.49,67.03 36.65,66.86 36.65,61.91 36.49,61.75 v36.49,57.95 35.99,57.78 33.52,55.31 v33.52,51.18
  pour Top: 0,80.01 0,0 114.3,0 114.3,80.01
  pour Bottom: 0,80.01 0,0 114.3,0 114.3,80.01
KLIMA1_SCL  (via drill 0.35)
  Top 0.508: R33.1 68.68,19.32 68.68,25.43 KLIMA1.B4 | v71.82,32.52 v71.82,36.65
  Bottom 0.508: v71.82,36.65 68.68,39.79 68.68,40.62 I2CEXTENDER1.7 | v71.82,32.52 71.16,31.86 71.16,28.07 68.68,25.59 KLIMA1.B4
KLIMA1_SDA
  Top 0.508: R32.1 64.88,19.32 64.88,24.27 66.04,25.43 KLIMA1.B3 65.88,25.59 68.02,27.74 68.68,27.74 70,29.06 70,31.86 67.2,34.67 67.2,36.82 63.4,40.62 61.09,40.62 I2CEXTENDER1.2
KLIMA2_SCL
  Top 0.508: R31.1 81.39,19.32 81.39,25.43 KLIMA2.B4 81.56,25.59 82.72,26.75 82.72,38.47 81.39,39.79 81.39,40.62 I2CEXTENDER2.7
KLIMA2_SDA
  Top 0.508: R30.1 77.6,19.32 77.6,24.43 78.59,25.43 KLIMA2.B3 78.42,25.59 78.42,26.09 76.77,27.74 73.47,27.74 70.99,30.21 70.99,37.31 73.64,39.95 73.64,40.62 I2CEXTENDER2.2
LED1_BLUE
  Top 0.508: R2.2 88.99,63.73 90.31,63.73 92.95,66.37 97.08,66.37 97.9,67.2 97.9,70 96.58,71.32 95.92,71.32 94.11,73.14 94.11,73.47 LED-HR.B2
LED1_GREEN
  Top 0.508: R1.2 92.79,63.73 95.43,63.73 98.56,66.86 98.56,71.49 96.58,73.47 LED-HR.B1
LED1_RED
  Top 0.508: R3.2 85.19,63.73 85.19,66.2 87.5,68.52 87.5,70 88.82,71.32 89.48,71.32 91.3,73.14 91.3,73.47 LED-HR.B3
LED2_BLUE  (via drill 0.35)
  Top 0.508: v74.79,66.37 77.43,63.73 R5.2
  Bottom 0.508: v74.79,66.37 74.79,70 76.11,71.32 79.25,71.32 81.39,73.47 LED-ZL.B2
LED2_GREEN
  Top 0.508: R4.2 81.39,63.73 81.39,64.72 83.05,66.37 84.37,66.37 85.19,67.2 85.19,72.15 83.87,73.47 LED-ZL.B1
LED2_RED
  Top 0.508: R6.2 73.8,63.73 73.8,69.01 76.11,71.32 76.77,71.32 78.59,73.14 78.59,73.47 LED-ZL.B3
LED3_BLUE
  Top 0.508: R8.2 66.04,63.73 65.55,63.73 62.08,67.2 62.08,70 63.4,71.32 66.53,71.32 68.68,73.47 LED-ZR.B2
LED3_GREEN
  Top 0.508: R7.2 70,63.73 70,64.72 72.48,67.2 72.48,72.15 71.16,73.47 LED-ZR.B1
LED3_RED  (via drill 0.35)
  Top 0.508: v60.92,66.2 58.45,63.73 R9.2
  Bottom 0.508: v60.92,66.2 60.92,68.85 63.4,71.32 64.06,71.32 66.04,73.3 LED-ZR.B3
LED4_BLUE
  Top 0.508: R11.2 54.65,63.73 56.13,63.73 58.78,66.37 58.94,66.37 59.77,67.2 59.77,70.17 58.61,71.32 57.95,71.32 55.8,73.47 LED-HL.B2
LED4_GREEN
  Top 0.508: R10.2 62.08,63.73 62.08,66.2 60.43,67.86 60.43,71.49 58.45,73.47 LED-HL.B1
LED4_RED
  Top 0.508: R12.2 50.69,63.73 50.69,65.88 49.37,67.2 49.37,70 50.69,71.32 51.35,71.32 53.49,73.47 LED-HL.B3
LED5_BLUE
  Top 0.508: R16.2 43.26,63.73 43.59,63.73 47.05,67.2 47.05,70.17 45.9,71.32 45.24,71.32 43.09,73.47 LED-VL.B2
LED5_GREEN
  Top 0.508: R15.2 47.05,63.73 47.05,66.2 47.71,66.86 47.71,71.49 45.73,73.47 LED-VL.B1
LED5_RED
  Top 0.508: R17.2 39.29,63.73 39.29,64.55 36.65,67.2 36.65,70 37.97,71.32 38.63,71.32 40.78,73.47 LED-VL.B3
LED6_BLUE
  Top 0.508: R19.2 31.86,63.73 31.86,64.55 34.34,67.03 34.34,70.17 33.19,71.32 32.52,71.32 30.38,73.47 LED-VR.B2
LED6_GREEN
  Top 0.508: R18.2 35.5,63.73 35.5,70.99 33.02,73.47 LED-VR.B1
LED6_RED
  Top 0.508: R20.2 27.9,63.73 27.41,63.73 23.94,67.2 23.94,70 25.26,71.32 25.92,71.32 28.07,73.47 LED-VR.B3
LED7_BLUE
  Top 0.508: R22.2 20.47,63.73 20.47,65.88 21.63,67.03 21.63,70.17 20.47,71.32 19.81,71.32 17.67,73.47 LED-VD.B2
LED7_GREEN
  Top 0.508: R21.2 24.11,63.73 24.11,66.04 22.29,67.86 22.29,71.65 20.47,73.47 LED-VD.B1
LED7_RED
  Top 0.508: R23.2 16.51,63.73 14.69,63.73 11.39,67.03 11.39,70.17 12.55,71.32 13.21,71.32 15.35,73.47 LED-VD.B3
MCP2317_1_GPB0
  Top 0.508: MCP23017_1.1 18.99,47.22 18.33,47.22 11.56,40.45 8.75,40.45 7.43,41.77 7.43,42.43 5.28,44.58 FRISCHWASSERTANK.B7
MCP2317_1_GPB1  (via drill 0.35)
  Top 0.508: v14.03,40.62 20.31,46.89 20.31,47.22 MCP23017_1.2 | v6.93,38.96 5.28,38.96 v4.62,39.62 | v2.81,42.76 2.81,44.91 4.79,46.89 5.12,46.89 FRISCHWASSERTANK.B6
  Bottom 0.508: v14.03,40.62 11.72,40.62 10.57,39.46 7.43,39.46 v6.93,38.96 | v4.62,39.62 2.81,41.44 v2.81,42.76
MCP2317_1_GPB2
  Top 0.508: FRISCHWASSERTANK.B5 4.79,49.53 1.98,46.72 1.98,42.27 3.8,40.45 4.95,40.45 5.61,39.79 15.68,39.79 21.46,45.57 21.46,47.22 MCP23017_1.3
MCP2317_1_GPB3  (via drill 0.35)
  Top 0.508: v22.78,49.03 22.78,47.38 MCP23017_1.4 | v7.1,62.41 5.78,62.41 5.12,61.75 3.3,61.75 2.15,60.59 2.15,54.81 4.79,52.17 5.12,52.17 FRISCHWASSERTANK.B4
  Bottom 0.508: v22.78,49.03 22.78,49.86 11.23,61.42 8.09,61.42 v7.1,62.41
MCP2317_1_GPB4
  Top 0.508: MCP23017_1.5 24.11,47.38 24.11,48.87 18.82,54.15 17.34,54.15 12.38,59.11 12.38,60.92 9.91,63.4 9.25,63.4 6.93,61.09 3.63,61.09 2.81,60.26 2.81,56.63 4.79,54.65 5.12,54.65 FRISCHWASSERTANK.B3
MCP2317_1_GPB5_E  (via drill 0.35)
  Top 0.508: v39.13,30.21 25.43,43.92 25.43,47.22 MCP23017_1.6 | v39.13,27.9 41.94,27.9 43.42,26.42 46.39,26.42 56.13,16.68 v63.23,16.68
  Bottom 0.508: v39.13,27.9 v39.13,30.21 | v63.23,16.68 84.7,16.68 87.01,14.36 99.89,14.36 101.04,13.21 101.04,7.43 100.38,6.77 100.38,4.95 99.56,4.13 93.45,4.13 91.3,6.27 GPIO_EXTENSION.B13
MCP2317_1_GPB6_E  (via drill 0.35)
  Top 0.508: v45.4,30.21 45.24,30.38 41.94,30.38 26.75,45.57 26.75,47.22 MCP23017_1.7 | v40.12,24.27 40.12,23.94 48.21,15.85 v62.74,15.85
  Bottom 0.508: v45.4,30.21 45.4,29.55 v40.12,24.27 | v62.74,15.85 76.77,15.85 78.92,13.7 99.56,13.7 100.38,12.88 100.38,9.91 99.22,8.75 96.09,8.75 94.11,6.77 94.11,6.44 GPIO_EXTENSION.B14
MCP2317_2_GPB3  (via drill 0.35)
  Top 0.508: v32.19,48.54 35.99,48.54 38.96,45.57 45.9,45.57 50.69,50.35 50.69,51.02 51.68,52.01 55.14,52.01 55.8,51.35 55.8,50.52 56.79,49.53 60.1,49.53 60.43,49.86 72.64,49.86 73.64,48.87 73.64,47.38 MCP23017_2.4
  Bottom 0.508: v32.19,48.54 32.19,48.21 12.38,28.4 12.38,18.49 11.56,17.67 8.75,17.67 7.43,18.99 7.43,22.12 5.28,24.27 FÄKALIENTANK.B6
MCP2317_2_GPB4  (via drill 0.35)
  Top 0.508: v57.78,56.13 58.28,55.64 58.28,53.16 59.27,52.17 71.32,52.17 74.79,48.7 74.79,47.38 MCP23017_2.5 | v31.53,36.65 27.24,36.65 23.61,33.02 22.12,33.02 12.38,23.28 12.38,18.49 11.56,17.67 8.75,17.67 7.43,18.99 7.43,24.6 5.28,26.75 FÄKALIENTANK.B5
  Bottom 0.508: v57.78,56.13 48.37,56.13 37.64,45.4 37.64,42.76 v31.53,36.65
MCP2317_2_GPB5  (via drill 0.35)
  Top 0.508: v59.44,55.31 60.43,54.32 70.17,54.32 76.11,48.37 76.11,47.38 MCP23017_2.6 | v29.39,37.64 29.39,38.47 28.89,38.96 8.09,38.96 7.26,38.14 v3.47,38.14
  Bottom 0.508: v59.44,55.31 48.54,55.31 38.3,45.07 38.3,42.27 31.86,35.83 31.2,35.83 v29.39,37.64 | v3.47,38.14 2.81,37.48 2.81,31.2 4.79,29.22 5.12,29.22 FÄKALIENTANK.B4
MCP2317_2_GPB6  (via drill 0.35)
  Top 0.508: v58.78,45.73 76.28,45.73 77.43,46.89 77.43,47.22 MCP23017_2.7 | v56.79,40.95 55.14,40.95 52.17,43.92 37.31,43.92 37.15,44.08 v34.51,44.08 | v28.56,38.14 8.59,38.14 7.43,36.98 7.43,33.85 5.28,31.7 FÄKALIENTANK.B3
  Bottom 0.508: v58.78,45.73 58.78,42.93 v56.79,40.95 | v28.56,38.14 v34.51,44.08
N$1  (via drill 0.35)
  Top 0.508: v70.33,48.54 70,48.21 70,47.38 MCP23017_2.1 | v91.14,59.27 92.62,60.76 R1.1
  Bottom 0.508: v70.33,48.54 70.83,48.54 71.32,48.04 76.77,48.04 88,59.27 v91.14,59.27
N$2  (via drill 0.35)
  Top 0.508: v71.49,49.03 71.16,48.7 71.16,47.38 MCP23017_2.2 | v87.34,60.76 88.82,60.76 R2.1
  Bottom 0.508: v71.49,49.03 83.21,60.76 v87.34,60.76
N$3  (via drill 0.35)
  Top 0.508: v72.48,48.87 72.48,47.38 MCP23017_2.3 | v90.47,60.76 90.47,61.75 90.14,62.08 86.35,62.08 85.19,60.92 R3.1
  Bottom 0.508: v72.48,48.87 74.13,48.87 85.19,59.93 89.65,59.93 v90.47,60.76
N$4
  Top 0.508: MCP23017_2.21 78.75,56.96 78.75,58.28 81.23,60.76 R4.1
N$5
  Top 0.508: MCP23017_2.22 77.43,56.96 77.43,60.76 R5.1
N$6
  Top 0.508: MCP23017_2.23 76.11,56.96 76.11,58.45 73.8,60.76 R6.1
N$7
  Top 0.508: MCP23017_2.24 74.79,56.96 74.79,57.45 72.64,59.6 71.16,59.6 70,60.76 R7.1
N$8
  Top 0.508: MCP23017_2.25 73.64,56.96 73.64,57.29 71.98,58.94 67.86,58.94 66.04,60.76 R8.1
N$9
  Top 0.508: MCP23017_2.26 72.31,56.79 72.31,56.3 70.99,54.98 64.22,54.98 58.45,60.76 R9.1
N$10  (via drill 0.35)
  Top 0.508: v64.55,55.8 70.5,55.8 70.99,56.3 70.99,56.79 MCP23017_2.27 | v60.92,55.8 56.79,59.93 v56.79,60.76 | v60.59,60.76 62.08,60.76 R10.1
  Bottom 0.508: v60.92,55.8 v64.55,55.8 | v60.59,60.76 v56.79,60.76
N$11  (via drill 0.35)
  Top 0.508: v61.25,59.11 63.4,56.96 69.84,56.96 MCP23017_2.28 | v56.3,59.11 54.65,60.76 R11.1
  Bottom 0.508: v56.3,59.11 v61.25,59.11
N$12  (via drill 0.35)
  Top 0.508: v78.75,48.87 78.75,47.38 MCP23017_2.8 | v83.71,62.41 82.72,63.4 v82.72,64.88 | v52.34,59.93 51.68,59.93 50.85,60.76 R12.1
  Bottom 0.508: v78.75,48.87 88.33,58.45 92.29,58.45 95.1,61.25 95.1,61.91 94.6,62.41 v83.71,62.41 | v82.72,64.88 69.18,64.88 64.22,59.93 v52.34,59.93
N$13  (via drill 0.35)
  Top 0.508: v31.37,58.12 28.73,58.12 28.07,57.45 28.07,56.96 MCP23017_1.21 | v35.5,62.24 45.57,62.24 46.89,60.92 R15.1
  Bottom 0.508: v35.5,62.24 v31.37,58.12
N$14
  Top 0.508: MCP23017_1.22 26.75,56.79 26.75,56.3 30.87,52.17 37.15,52.17 39.62,54.65 41.77,54.65 43.09,55.97 43.09,60.76 R16.1
N$15
  Top 0.508: MCP23017_1.23 25.43,56.96 25.43,57.29 27.08,58.94 37.48,58.94 39.29,60.76 R17.1
N$16  (via drill 0.35)
  Top 0.508: v23.28,55.64 24.11,56.46 24.11,56.79 MCP23017_1.24 | v16.02,62.24 17.5,62.24 v18.66,63.4 | v34.18,62.24 35.5,60.92 R18.1
  Bottom 0.508: v23.28,55.64 22.62,55.64 v16.02,62.24 | v18.66,63.4 33.02,63.4 v34.18,62.24
N$17
  Top 0.508: MCP23017_1.25 22.95,56.96 22.95,57.29 25.26,59.6 30.54,59.6 31.7,60.76 R19.1
N$18
  Top 0.508: MCP23017_1.26 21.46,56.79 21.46,56.3 20.97,55.8 18.49,55.8 18.16,56.13 18.16,61.09 19.15,62.08 26.75,62.08 27.9,60.92 R20.1
N$19
  Top 0.508: MCP23017_1.27 20.47,56.96 20.47,57.45 23.77,60.76 24.11,60.76 R21.1
N$20
  Top 0.508: MCP23017_1.28 19.15,56.96 19.15,59.6 20.31,60.76 R22.1
N$21
  Top 0.508: MCP23017_2.18 82.55,57.29 83.21,57.95 88.16,57.95 89.98,56.13 91.3,56.13 R34.2
N$22
  Top 0.508: MCP23017_1.18 31.86,56.79 31.86,56.3 32.36,55.8 40.45,55.8 40.62,55.97 R35.2
N$23
  Bottom 0.508: HX711.E+ 22.95,36.82 22.95,36.32 24.77,34.51 24.77,32.85 24.93,32.69 24.93,8.42 22.95,6.44 GASWAAGE.B4
N$24
  Bottom 0.508: HX711.E- 22.95,34.18 22.95,33.68 24.27,32.36 24.27,9.91 23.11,8.75 22.45,8.75 20.47,6.77 20.47,6.44 GASWAAGE.B3
N$25
  Top 0.508: HX711.A- 22.95,31.7 22.95,31.2 24.27,29.88 24.27,9.91 23.11,8.75 19.81,8.75 17.83,6.77 17.83,6.44 GASWAAGE.B2
N$26
  Top 0.508: HX711.A+ 22.78,29.06 22.78,28.73 15.19,21.13 15.19,14.2 13.87,12.88 13.87,7.76 15.19,6.44 GASWAAGE.B1
N$29
  Top 0.508: R23.1 16.51,56.79 18.16,55.14 20.47,55.14 27.9,47.71 27.9,47.38 MCP23017_1.8
RP_GPIO4  (via drill 0.35)
  Top 0.508: v111.44,37.64 108.47,40.62 105,40.62 v101.87,43.75 | v95.1,55.14 95.1,60.76 v94.27,61.58 | v71.65,54.48 v75.45,54.48 | v36.65,17.17 36.65,10.07 37.97,8.75 41.11,8.75 43.09,6.77 43.09,6.44 RADAR.B3
  Bottom 0.508: v111.44,37.64 111.44,28.4 107.97,24.93 107.97,24.27 RASPBERRY-PI.7 | v101.87,43.75 100.88,44.74 100.88,44.91 98.23,47.55 98.23,52.01 v95.1,55.14 | v94.27,61.58 82.72,61.58 75.62,54.48 v75.45,54.48 | v71.65,54.48 70.33,54.48 70.17,54.32 60.43,54.32 60.26,54.48 54.15,54.48 53.33,53.66 53.33,53 52.34,52.01 51.68,52.01 50.69,51.02 50.69,29.55 49.03,27.9 47.38,27.9 v36.65,17.17
RP_GPIO5
  Bottom 0.508: GEHÄUSEDECKEL.16 92.79,22.78 99.39,22.78 101.87,25.26 101.87,31.53 96.58,36.82 96.58,40.12 99.39,42.93 104.67,42.93 105,43.26 105.99,43.26 106.66,43.92 106.66,44.91 105.83,45.73 105,45.73 104.18,46.56 104.18,50.02 105,50.85 106.49,50.85 107.81,52.17 RASPBERRY-PI.29
RP_GPIO6  (via drill 0.35)
  Top 0.508: 101.37,52.17 100.55,52.17 R29.2 | 101.37,52.17 102.86,53.66 104.67,53.66 105,53.33 106.66,53.33 107.81,54.48 RASPBERRY-PI.31 | v95.1,33.85 v95.1,28.4 | v95.1,38.47 95.1,40.95 94.44,41.6 v94.44,42.93 | v100.55,46.39 v95.43,46.39 | v102.2,50.52 102.2,51.35 101.37,52.17
  Bottom 0.508: v95.1,28.4 93.45,26.75 92.46,26.75 91.14,25.43 90.31,25.43 GEHÄUSEDECKEL.13 | v95.1,38.47 v95.1,33.85 | v94.44,42.93 94.44,45.4 v95.43,46.39 | v100.55,46.39 100.55,48.87 v102.2,50.52
RP_GPIO7_E  (via drill 0.35)
  Top 0.508: v57.62,57.12 55.97,55.47 v55.97,52.34
  Bottom 0.508: v57.62,57.12 58.28,57.78 76.77,57.78 83.38,64.39 103.19,64.39 104.01,63.56 108.31,63.56 109.13,62.74 109.13,51.51 108.47,50.85 107.48,50.85 106.66,50.02 106.66,49.03 105.5,47.88 105.5,47.05 RASPBERRY-PI.26 | v55.97,52.34 55.97,38.14 58.12,35.99 58.12,32.85 54.15,28.89 54.15,23.44 44.58,13.87 44.58,7.26 50.52,1.32 76.44,1.32 77.6,2.48 77.6,3.14 76.61,4.13 73.14,4.13 70.99,6.27 GPIO_EXTENSION.B5
RP_GPIO8_E
  Top 0.508: RASPBERRY-PI.24 105.5,44.58 106.32,44.58 107.48,45.73 108.47,45.73 110.95,43.26 111.94,43.26 112.6,42.6 112.6,17.67 102.36,7.43 102.36,6.44 97.9,1.98 71.32,1.98 68.68,4.62 68.68,6.27 GPIO_EXTENSION.B4
RP_GPIO9_E
  Bottom 0.508: RASPBERRY-PI.21 107.81,41.77 107.81,40.95 106.66,39.79 106.66,38.8 105.99,38.14 105,38.14 104.18,37.31 104.18,36.32 105,35.5 105.99,35.5 106.66,34.84 106.66,33.85 105.83,33.02 105,33.02 102.53,30.54 102.53,20.14 104.84,17.83 105.83,17.83 106.66,17 106.66,11.56 102.03,6.93 102.03,4.62 100.22,2.81 89.65,2.81 86.51,5.94 86.51,6.27 GPIO_EXTENSION.B11
RP_GPIO10_E
  Bottom 0.508: RASPBERRY-PI.19 107.81,39.29 107.81,38.47 106.66,37.31 106.66,36.32 107.48,35.5 108.47,35.5 109.13,34.84 109.13,31.2 108.31,30.38 107.31,30.38 106.66,29.72 106.66,23.61 107.48,22.78 108.47,22.78 110.78,20.47 110.78,6.27 105.99,1.49 88,1.49 83.87,5.61 83.87,6.27 GPIO_EXTENSION.B10
RP_GPIO12_E  (via drill 0.35)
  Top 0.508: v103.35,58.94 102.53,58.94 101.7,59.77 101.7,61.58 100.71,62.57 v100.71,66.37 | v34.67,54.81 33.85,54.81 v32.03,53 | v42.27,2.81 66.86,2.81 v67.53,3.47 | v70.99,3.47 73.8,6.27 GPIO_EXTENSION.B6
  Bottom 0.508: v103.35,58.94 103.85,58.45 105.83,58.45 106.66,57.62 106.66,56.63 105.5,55.47 105.5,54.65 RASPBERRY-PI.32 | v100.71,66.37 75.95,66.37 75.12,65.55 61.42,65.55 57.45,61.58 41.44,61.58 v34.67,54.81 | v32.03,53 32.03,50.85 33.02,49.86 33.02,43.75 25.43,36.16 25.43,33.19 25.92,32.69 25.92,5.61 28.73,2.81 v42.27,2.81 | v70.99,3.47 v67.53,3.47
RP_GPIO13  (via drill 0.35)
  Top 0.508: RASPBERRY-PI.33 107.81,57.12 106.66,55.97 100.55,55.97 R28.2 100.38,55.64 99.22,54.48 99.22,50.85 99.56,50.52 101.04,50.52 102.2,49.37 102.2,45.24 101.54,44.58 v100.05,44.58
  Bottom 0.508: v100.05,44.58 94.27,38.8 94.27,32.85 93.28,31.86 92.46,31.86 91.14,30.54 90.31,30.54 GEHÄUSEDECKEL.9
RP_GPIO14_E  (via drill 0.35)
  Top 0.508: v109.96,13.87 103.19,7.1 103.19,6.27 98.23,1.32 70.83,1.32 66.04,6.11 GPIO_EXTENSION.B3
  Bottom 0.508: v109.96,13.87 109.96,18.82 108.47,20.31 107.48,20.31 106.66,21.13 106.66,22.12 105.5,23.28 105.5,24.11 RASPBERRY-PI.8
RP_GPIO16_E  (via drill 0.35)
  Top 0.508: v104.01,45.57 104.01,47.38 104.84,48.21 105.83,48.21 106.66,49.03 106.66,50.02 107.48,50.85 108.47,50.85 109.13,51.51 109.13,60.26 108.47,60.92 107.48,60.92 106.32,59.77 105.5,59.77 RASPBERRY-PI.36 | v95.92,45.57 v101.37,45.57 | v91.14,31.7 91.14,31.2 91.3,31.04 91.3,29.88 90.47,29.06 89.15,29.06 84.7,24.6 84.7,23.94 86.84,21.79 v88.16,21.79 | v89.15,17.34 95.92,17.34 100.38,12.88 100.38,9.91 99.22,8.75 78.26,8.75 76.28,6.77 76.28,6.44 GPIO_EXTENSION.B7
  Bottom 0.508: v101.37,45.57 v104.01,45.57 | v95.92,45.57 95.92,43.09 93.94,41.11 93.94,40.28 92.95,39.29 92.29,39.29 91.3,38.3 91.3,31.86 v91.14,31.7 | v88.16,21.79 88.16,18.33 v89.15,17.34
RP_GPIO17
  Top 0.508: 93.12,31.7 92.95,31.86 92.13,31.86 90.97,33.02 GEHÄUSEDECKEL.7 | 93.12,31.7 93.94,30.87 93.94,28.4 95.59,26.75 96.91,26.75 D1.C | 93.12,31.7 93.94,32.52 93.94,33.85 97.57,37.48 97.57,37.97 R25.1 97.74,37.31 98.4,36.65 100.55,36.65 101.54,35.66 105.83,35.66 106.66,34.84 106.66,33.85 107.48,33.02 108.47,33.02 109.13,32.36 109.13,31.2 107.97,30.05 107.97,29.22 RASPBERRY-PI.11
RP_GPIO18  (via drill 0.35)
  Top 0.508: RASPBERRY-PI.12 105.33,29.22 104.18,30.38 100.55,30.38 R24.1 100.22,30.38 99.39,29.55 v99.06,29.55 | v45.9,16.34 46.72,16.34 48.04,15.02 88,15.02 v89.32,16.34 | v94.93,21.96 94.93,25.43 v95.43,25.92
  Bottom 0.508: KüHLSCHR..B3 33.02,8.59 35.5,11.06 35.5,13.37 38.47,16.34 v45.9,16.34 | v94.93,21.96 v89.32,16.34 | v99.06,29.55 v95.43,25.92
RP_GPIO19  (via drill 0.35)
  Top 0.508: RASPBERRY-PI.35 107.81,59.6 106.66,58.45 105,58.45 104.67,58.12 102.36,58.12 100.88,59.6 100.55,59.6 R26.2 100.38,59.77 v98.89,61.25
  Bottom 0.508: v98.89,61.25 92.13,54.48 92.13,44.91 90.81,43.59 87.67,43.59 85.03,40.95 85.03,37.64 88,34.67 88,24.93 89.32,23.61 89.48,23.61 90.14,22.95 GEHÄUSEDECKEL.15
RP_GPIO20_E  (via drill 0.35)
  Top 0.508: v64.06,38.8 64.06,36.32 v58.78,31.04 | v75.95,3.3 78.59,5.94 78.59,6.27 GPIO_EXTENSION.B8
  Bottom 0.508: v64.06,38.8 65.71,40.45 65.71,45.9 76.28,56.46 76.61,56.46 83.87,63.73 102.86,63.73 104.34,62.24 105.33,62.24 RASPBERRY-PI.38 | v58.78,31.04 58.78,16.02 58.12,15.35 58.12,6.44 61.91,2.64 75.29,2.64 v75.95,3.3
RP_GPIO21_E  (via drill 0.35)
  Top 0.508: v103.02,62.41 105.33,64.72 RASPBERRY-PI.40
  Bottom 0.508: v103.02,62.41 97.24,62.41 84.2,49.37 83.54,49.37 74.95,40.78 74.95,34.51 71.82,31.37 71.82,23.77 66.86,18.82 62.57,18.82 58.78,15.02 58.78,13.04 59.6,12.22 59.6,9.91 60.76,8.75 79.25,8.75 81.23,6.77 81.23,6.44 GPIO_EXTENSION.B9
RP_GPIO22  (via drill 0.35)
  Top 0.508: v106.66,32.69 106.32,33.02 105,33.02 103.85,34.18 100.55,34.18 R27.2 100.38,34.01 v99.22,32.85
  Bottom 0.508: v106.66,32.69 107.81,33.85 107.81,34.18 RASPBERRY-PI.15 | v99.22,32.85 95.59,29.22 92.29,29.22 91.14,28.07 90.31,28.07 GEHÄUSEDECKEL.11
RP_GPIO23  (via drill 0.35)
  Top 0.508: v102.86,33.35 102.03,33.35 100.71,32.03 v99.89,32.03 | v94.44,26.58 87.83,26.58 v85.52,24.27 | v69.01,17.83 60.59,17.83 49.53,28.89 49.53,30.54 48.37,31.7 HX711.DT
  Bottom 0.508: HX711-EXTERN.B3 33.02,25.09 35,23.11 37.15,23.11 45.73,31.7 48.21,31.7 HX711.DT | v102.86,33.35 103.68,34.18 105.33,34.18 RASPBERRY-PI.16 | v94.44,26.58 v99.89,32.03 | v85.52,24.27 82.88,24.27 76.44,17.83 v69.01,17.83
RP_GPIO24  (via drill 0.35)
  Top 0.508: v93.61,45.73 94.44,45.73 95.43,44.74 96.25,44.74 104.01,36.98 105.33,36.98 RASPBERRY-PI.18 | v93.61,53.66 93.61,56.3 91.47,58.45 88.66,58.45 87.5,59.6 83.87,59.6 82.72,60.76 82.72,61.91 82.55,62.08 53.33,62.08 53.16,61.91 53.16,58.78 v48.37,53.99
  Bottom 0.508: HX711-EXTERN.B2 30.54,25.43 30.54,25.09 33.19,22.45 39.46,22.45 46.06,29.06 48.21,29.06 HX711.SCK 48.37,29.39 49.53,30.54 49.53,35.17 48.37,36.32 v48.37,53.99 | v93.61,53.66 v93.61,45.73
RP_GPIO25  (via drill 0.35)
  Top 0.508: v103.19,52.83 103.19,44.91 105.33,42.76 105.33,41.94 RASPBERRY-PI.22 | v102.53,60.1 102.53,61.75 101.54,62.74 101.54,73.14 97.57,77.1 13.37,77.1 4.79,68.52 v4.79,62.57
  Bottom 0.508: v103.19,52.83 103.19,53.49 102.53,54.15 v102.53,60.1 | v4.79,62.57 4.79,62.24 2.81,60.26 2.81,43.92 4.79,41.94 5.12,41.94 FRISCHWASSERTANK.B8
RP_GPIO26
  Bottom 0.508: GEHÄUSEDECKEL.2 92.79,40.78 92.79,53.99 99.72,60.92 106.66,60.92 107.81,62.08 RASPBERRY-PI.37
RP_GPIO27  (via drill 0.35)
  Top 0.508: v101.04,28.07 104.84,28.07 105,27.9 105.83,27.9 106.66,28.73 106.66,30.54 107.81,31.7 RASPBERRY-PI.13
  Bottom 0.508: v101.04,28.07 98.07,25.09 95.1,25.09 94.93,25.26 92.79,25.26 GEHÄUSEDECKEL.14
RP_GPIO_11_E  (via drill 0.35)
  Top 0.508: v109.13,37.48 109.13,36.98 111.11,35 111.11,17.17 101.21,7.26 v101.21,6.44
  Bottom 0.508: v109.13,37.48 109.13,42.43 107.97,43.59 107.97,44.41 RASPBERRY-PI.23 | v101.21,6.44 101.21,4.79 99.89,3.47 91.47,3.47 88.99,5.94 88.99,6.27 GPIO_EXTENSION.B12
SCL  (via drill 0.35)
  Top 0.508: D1.A 101.04,26.58 101.04,23.44 100.55,22.95 R14.1 | RASPBERRY-PI.5 107.81,21.63 107.15,21.63 105.83,22.95 101.54,22.95 101.21,23.28 R14.1 | v83.87,48.54 83.87,47.38 MCP23017_2.12 | MCP23017_1.12 33.02,46.89 34.67,45.24 38.14,45.24 38.8,44.58 53.33,44.58 56.13,41.77 60.26,41.77 60.43,41.94 62.41,41.94 | 62.41,41.94 64.72,41.94 68.52,38.14 I2CEXTENDER1.6 68.68,38.3 72.31,41.94 75.45,41.94 78.09,39.29 | v62.41,42.1 62.41,41.94 | 78.09,39.29 79.25,38.14 81.23,38.14 I2CEXTENDER2.6 | v99.06,23.61 99.72,22.95 100.22,22.95 R14.1 | v85.85,37.97 81.89,41.94 80.73,41.94 78.09,39.29
  Bottom 0.508: v83.87,48.54 83.87,47.55 85.03,46.39 85.03,45.73 83.87,44.58 80.9,44.58 79.91,43.59 79.91,39.46 81.23,38.14 I2CEXTENDER2.6 | v62.41,42.1 62.41,44.91 59.77,47.55 59.77,50.69 I2C-EXTENSION.9 | ADX345.B4 55.8,6.44 55.8,6.77 53.49,9.08 47.71,9.08 45.57,11.23 45.57,13.87 57.95,26.25 57.95,31.7 59.6,33.35 59.6,35.99 60.43,36.82 67.36,36.82 68.52,37.97 I2CEXTENDER1.6 | v99.06,23.61 93.61,23.61 92.95,24.27 89.65,24.27 88.66,25.26 88.66,35.17 v85.85,37.97
SDA  (via drill 0.35)
  Top 0.508: v84.2,46.06 85.03,46.89 85.03,47.22 MCP23017_2.13 | v75.78,40.45 75.78,40.12 73.8,38.14 I2CEXTENDER2.3 | v103.35,20.64 101.87,19.15 100.55,19.15 R13.1 | v35,46.06 34.34,46.72 34.34,47.22 MCP23017_1.13 | v36.82,43.26 51.84,43.26 56.96,38.14 | 56.96,38.14 60.92,38.14 I2CEXTENDER1.3 | v57.29,24.43 57.29,34.18 56.13,35.33 56.13,37.31 56.96,38.14 | v76.77,2.81 v87.83,2.81
  Bottom 0.508: v84.2,46.06 81.39,46.06 v75.78,40.45 | v103.35,20.64 104.67,20.64 105,20.31 106.49,20.31 107.81,18.99 RASPBERRY-PI.3 107.97,18.82 107.97,18.16 109.13,17 109.13,13.04 102.69,6.6 102.69,4.29 100.55,2.15 88.49,2.15 v87.83,2.81 | v35,46.06 35,45.07 v36.82,43.26 | I2C-EXTENSION.10 59.6,53.33 59.6,52.34 58.45,51.18 58.45,47.88 59.6,46.72 59.6,39.46 I2CEXTENDER1.3 61.09,37.97 64.39,37.97 66.37,39.95 66.37,40.28 68.02,41.94 69.18,41.94 72.97,38.14 73.64,38.14 I2CEXTENDER2.3 | 57.29,4.95 56.46,4.13 55.31,4.13 53.49,5.94 53.49,6.27 ADX345.B3 | v57.29,24.43 57.29,4.95 | v76.77,2.81 75.95,1.98 60.26,1.98 57.29,4.95